# EasyEDA Pro project ProPrj_四串锂电池电源_2025-05-16.epro, schematic SW7203

## Sheets
1 电池保护: Board Name: Board1; Create Date: 2025-04-14; Page Name: 电池保护; Project Name: 四串锂电池电源; Schematic Name: SW7203; Update Date: 2025-04-15; Company: 嘉立创EDA; Page Size: A4; Version: V1.0
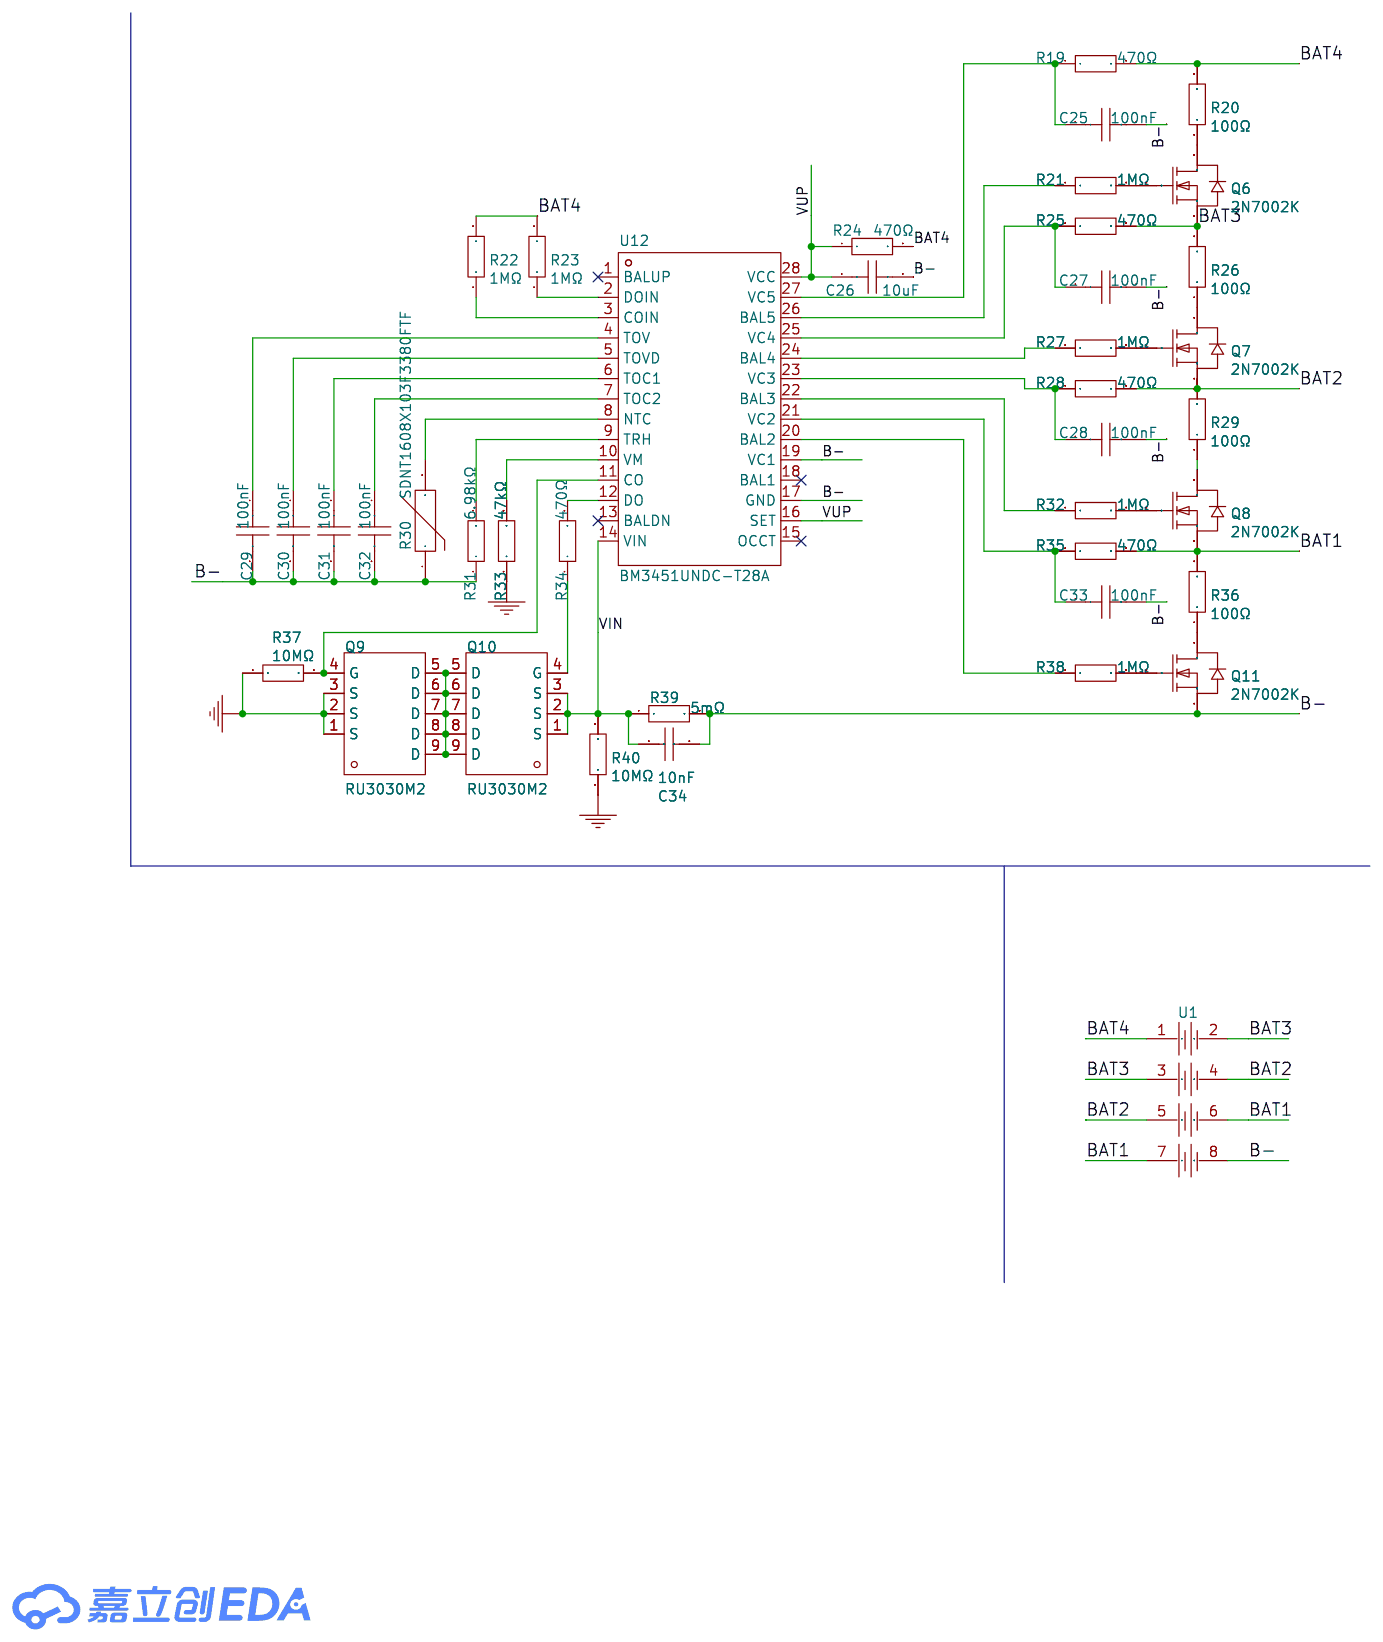
[diagram p0: 电池保护]
2 电源管理: Page Name: 电源管理; Schematic Name: Schematic1; Update Date: 2025-04-14
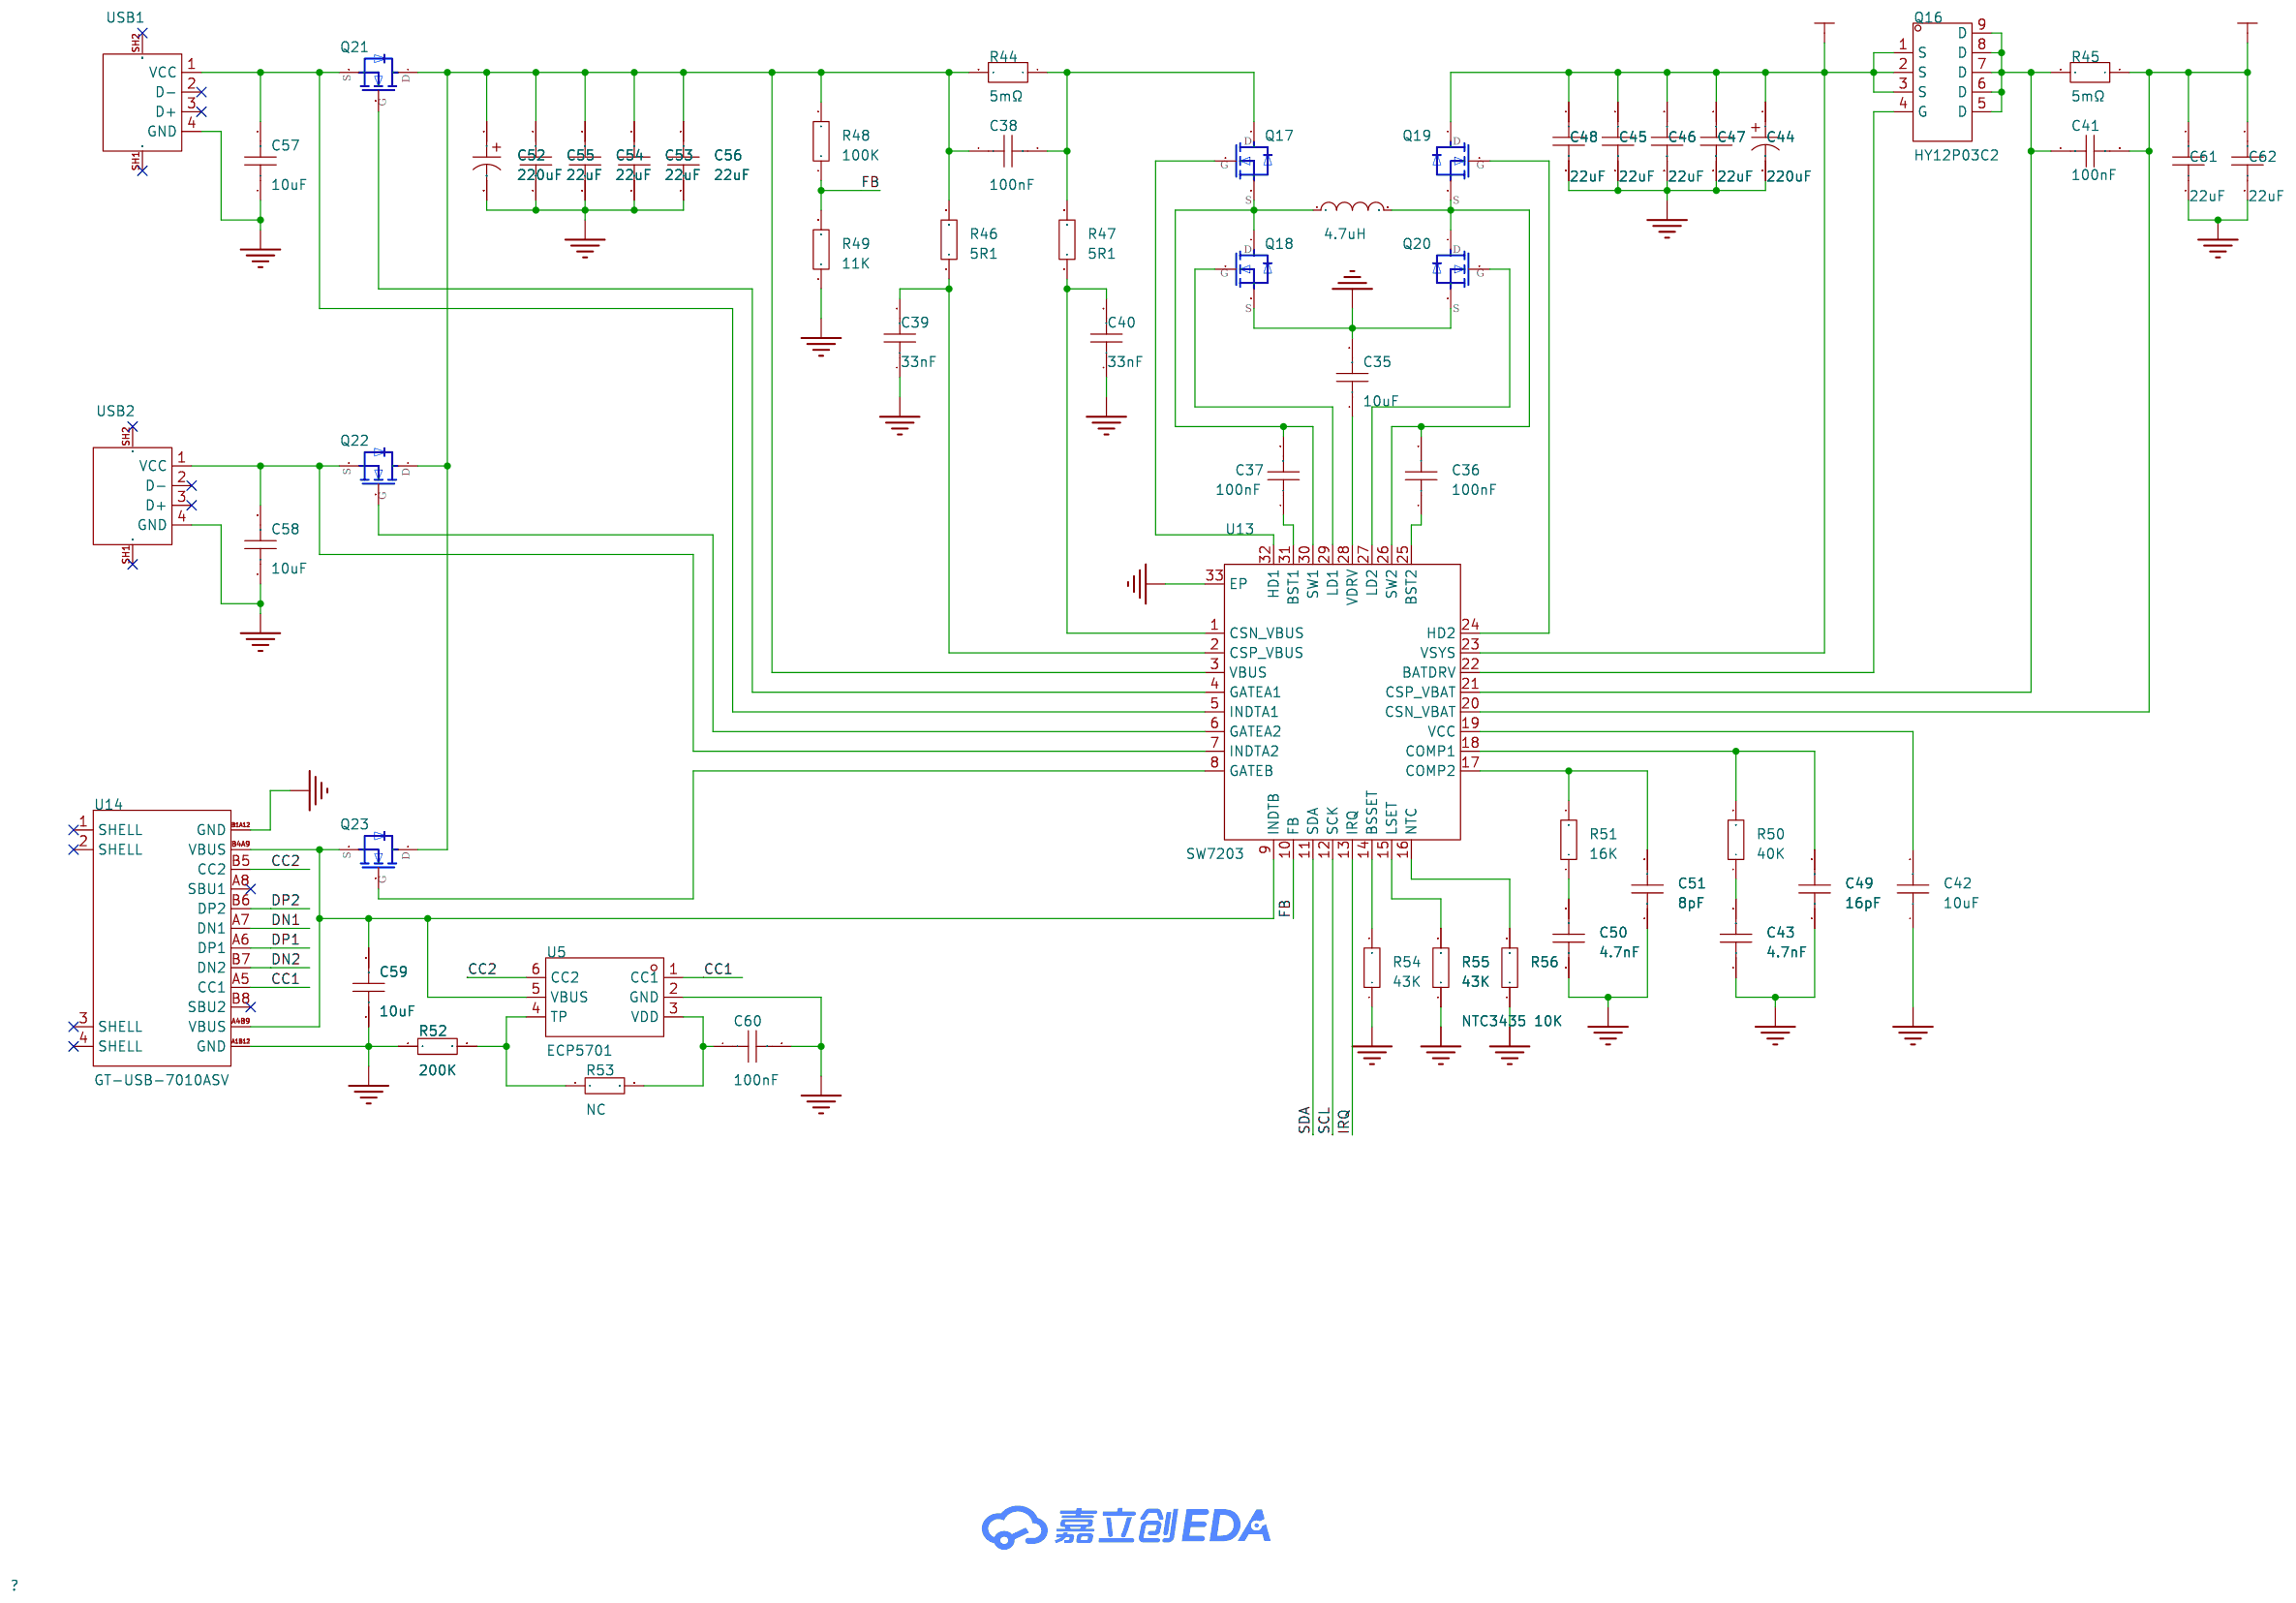
[diagram p1: 电源管理]

## Parts
sheet 电池保护
C25  100nF  [C0603]
C26  10uF  [C0603]
C27  100nF  [C0603]
C28  100nF  [C0603]
C29  100nF  [C0603]
C30  100nF  [C0603]
C31  100nF  [C0603]
C32  100nF  [C0603]
C33  100nF  [C0603]
C34  10nF  [C0603]
Q6  2N7002K  [SOT-23-3_L2.9-W1.3-P1.90-LS2.4-BL-1]
Q7  2N7002K  [SOT-23-3_L2.9-W1.3-P1.90-LS2.4-BL-1]
Q8  2N7002K  [SOT-23-3_L2.9-W1.3-P1.90-LS2.4-BL-1]
Q9  RU3030M2  [PDFN3333-8_L3.1-W3.2-P0.65-LS3.4-BL]
Q10  RU3030M2  [PDFN3333-8_L3.1-W3.2-P0.65-LS3.4-BL]
Q11  2N7002K  [SOT-23-3_L2.9-W1.3-P1.90-LS2.4-BL-1]
R19  470Ω  [R0603]
R20  100Ω  [R0603]
R21  1MΩ  [R0603]
R22  1MΩ  [R0603]
R23  1MΩ  [R0603]
R24  470Ω  [R0603]
R25  470Ω  [R0603]
R26  100Ω  [R0603]
R27  1MΩ  [R0603]
R28  470Ω  [R0603]
R29  100Ω  [R0603]
R30  SDNT1608X103F3380FTF  [R0603]
R31  6.98kΩ  [R0603]
R32  1MΩ  [R0603]
R33  47kΩ  [R0603]
R34  470Ω  [R0603]
R35  470Ω  [R0603]
R36  100Ω  [R0603]
R37  10MΩ  [R0603]
R38  1MΩ  [R0603]
R39  5mΩ  [R1206]
R40  10MΩ  [R0603]
U1  -  [21700四节电池仓]
U12  BM3451UNDC-T28A  [TSSOP-28_L9.7-W4.4-P0.65-LS6.4-BL]
sheet 电源管理
C35  10uF  [C0603]
C36  100nF  [C0603]
C37  100nF  [C0603]
C38  100nF  [C0603]
C39  33nF  [C0603]
C40  33nF  [C0603]
C41  100nF  [C0603]
C42  10uF  [C0805]
C43  4.7nF  [C0805]
C44  220uF  [CAP-SMD_BD8.0-L8.3-W8.3-LS9.0-FD]
C45  22uF  [C0805]
C46  22uF  [C0805]
C47  22uF  [C0805]
C48  22uF  [C0805]
C49  16pF  [C0805]
C50  4.7nF  [C0805]
C51  8pF  [C0805]
C52  220uF  [CAP-SMD_BD8.0-L8.3-W8.3-LS9.0-FD]
C53  22uF  [C0805]
C54  22uF  [C0805]
C55  22uF  [C0805]
C56  22uF  [C0805]
C57  10uF  [C0805]
C58  10uF  [C0805]
C59  10uF  [C0805]
C60  100nF  [C0603]
C61  22uF  [C0805]
C62  22uF  [C0805]
Q16  HY12P03C2  [DFN-8_L5.9-W5.2-P1.27-LS6.2-BL]
Q17  TPN2R703NL  [TSON3x3]
Q18  TPN2R703NL  [TSON3x3]
Q19  TPN2R703NL  [TSON3x3]
Q20  TPN2R703NL  [TSON3x3]
Q21  TPN2R703NL  [TSON3x3]
Q22  TPN2R703NL  [TSON3x3]
Q23  TPN2R703NL  [TSON3x3]
R44  5mΩ  [RES-SMD_L6.4-W3.2-1]
R45  5mΩ  [RES-SMD_L6.4-W3.2-1]
R46  5R1  [R0603]
R47  5R1  [R0603]
R48  100K  [R0603]
R49  11K  [R0603]
R50  40K  [R0603]
R51  16K  [R0603]
R52  200K  [R0603]
R53  NC  [R0603]
R54  43K  [R0603]
R55  43K  [R0603]
R56  NTC3435 10K  [R0603]
U5  ECP5701  [SOT-23-6_L2.9-W1.6-P0.95-LS2.8-BR]
U6  4.7uH  [IND-SMD_L11.0-W10.0]
U13  SW7203  [QFN-32_L4.0-W4.0-P0.40-TL-EP2.7]
U14  GT-USB-7010ASV  [USB-C-SMD_G-SWITCH_GT-USB-7010ASV]
USB1  -  [USB_ Type-A]
USB2  -  [USB_ Type-A]

## Library data of the parts
C25 C27-C33 = CGA0603X7R104K500JT: 容值:100nF;精度:±10%;额定电压:50V;材质(温度系数):X7R;; LCSC Part Name: 100nF ±10% 50V; Supplier Part: C6119867; Manufacturer: HRE(芯声); Supplier Footprint: 0603; JLCPCB Part Class: Extended Part; Supplier: LCSC; Tolerance: ±10%; Voltage Rated: 50V; Temperature Coefficient: X7R
C26 = CL10A106MA8NRNC: 容值:10uF;精度:±20%;额定电压:25V;材质(温度系数):X5R;; LCSC Part Name: 10uF ±20% 25V; Supplier Part: C96446; Manufacturer: SAMSUNG(三星); Supplier Footprint: 0603; JLCPCB Part Class: Basic Part; Datasheet: https://atta.szlcsc.com/upload/public/pdf/source/20160218/1457707763339.pdf; Supplier: LCSC; Tolerance: ±20%; Voltage Rated: 25V; Temperature Coefficient: X5R
C34 = CC0603KRX7R9BB103: 容值:10nF;精度:±10%;额定电压:50V;材质(温度系数):X7R;; LCSC Part Name: 10nF ±10% 50V; Supplier Part: C100042; Manufacturer: YAGEO(国巨); Supplier Footprint: 0603; JLCPCB Part Class: Extended Part; Datasheet: https://atta.szlcsc.com/upload/public/pdf/source/20181008/C309510_22F155564471FAF6A489F7D68F34234E.pdf; Supplier: LCSC; Tolerance: ±10%; Voltage Rated: 50V; Temperature Coefficient: X7R
Q6-Q8 Q11 = 2N7002K_C3008053: 类型:1个N沟道;漏源电压(Vdss):60V;连续漏极电流(Id):300mA;功率(Pd):350mW;导通电阻(RDS(on)@Vgs,Id):2.2Ω@10V,300mA;阈值电压(Vgs(th)@Id):1.6V@250uA;; LCSC Part Name: 1个N沟道 耐压:60V 电流:300mA; Supplier Part: C3008053; Manufacturer: MSKSEMI(美森科); Supplier Footprint: SOT-23; JLCPCB Part Class: Extended Part; Datasheet: https://atta.szlcsc.com/upload/public/pdf/source/20231010/5AB8D059FA255FE9F5E2F13E941A7E6F.pdf; Supplier: LCSC; Type: 1个N沟道; Drain Source Voltage (Vdss): 60V; Continuous Drain Current (Id): 300mA; Power Dissipation (Pd): 350mW; Drain Source On Resistance (RDS(on)@Vgs,Id): 2.2Ω@10V,300mA; Gate Threshold Voltage (Vgs(th)@Id): 1.6V@250uA; Total Gate Charge (Qg@Vgs): 3.7nC@10V; Input Capacitance (Ciss@Vds): 25.5pF@30V; Reverse Transfer Capacitance (Crss@Vds): 7.8pF@30V; Operating Temperature: -50℃~+150℃@(Tj)
Q9 Q10 = RU3030M2: 类型:1个N沟道;漏源电压(Vdss):30V;连续漏极电流(Id):30A;功率(Pd):29W;导通电阻(RDS(on)@Vgs,Id):15mΩ@10V,20A;阈值电压(Vgs(th)@Id):2.5V@250uA;; LCSC Part Name: 1个N沟道 耐压:30V 电流:30A; Supplier Part: C180957; Manufacturer: Ruichips(锐骏半导体); Supplier Footprint: PDFN3333-8; JLCPCB Part Class: 扩展库; Datasheet: https://atta.szlcsc.com/upload/public/pdf/source/20180301/C180957_15198944352791383984.pdf; Supplier: LCSC; Type: 1个N沟道; Drain Source Voltage (Vdss): 30V; Continuous Drain Current (Id): 30A; Power Dissipation (Pd): 29W; Drain Source On Resistance (RDS(on)@Vgs,Id): 15mΩ@10V,20A; Gate Threshold Voltage (Vgs(th)@Id): 2.5V@250uA
R19 R24 R25 R28 R34 R35 = 0603WAF4700T5E: 电阻类型:厚膜电阻;阻值:470Ω;精度:±1%;功率:100mW;最大工作电压:75V;温度系数:±100ppm/℃;; LCSC Part Name: 470Ω ±1% 100mW 厚膜电阻; Supplier Part: C23179; Manufacturer: UNI-ROYAL(厚声); Supplier Footprint: 0603; JLCPCB Part Class: Basic Part; Datasheet: https://atta.szlcsc.com/upload/public/pdf/source/20200306/C422600_1E6D84923E4A46A82E41ADD87F860B5C.pdf; Supplier: LCSC; Type: 厚膜电阻; Tolerance: ±1%; Power(Watts): 100mW; Overload Voltage (Max): 75V; Temperature Coefficient: ±100ppm/℃; Operating Temperature Range: -55℃~+155℃
R20 R26 R29 R36 = 0603WAF1000T5E: 电阻类型:厚膜电阻;阻值:100Ω;精度:±1%;功率:100mW;最大工作电压:75V;温度系数:±200ppm/℃;; LCSC Part Name: 100Ω ±1% 100mW 厚膜电阻; Supplier Part: C22775; Manufacturer: UNI-ROYAL(厚声); Supplier Footprint: 0603; JLCPCB Part Class: Basic Part; Datasheet: https://atta.szlcsc.com/upload/public/pdf/source/20200306/C422600_1E6D84923E4A46A82E41ADD87F860B5C.pdf; Supplier: LCSC; Type: 厚膜电阻; Tolerance: ±1%; Power(Watts): 100mW; Overload Voltage (Max): 75V; Temperature Coefficient: ±200ppm/℃; Operating Temperature Range: -55℃~+155℃
R21-R23 R27 R32 R38 = 0603WAF1004T5E: 电阻类型:厚膜电阻;阻值:1MΩ;精度:±1%;功率:100mW;最大工作电压:75V;温度系数:±100ppm/℃;; LCSC Part Name: 1MΩ ±1% 100mW 厚膜电阻; Supplier Part: C22935; Manufacturer: UNI-ROYAL(厚声); Supplier Footprint: 0603; JLCPCB Part Class: Basic Part; Datasheet: https://atta.szlcsc.com/upload/public/pdf/source/20200306/C422600_1E6D84923E4A46A82E41ADD87F860B5C.pdf; Supplier: LCSC; Type: 厚膜电阻; Tolerance: ±1%; Power(Watts): 100mW; Overload Voltage (Max): 75V; Temperature Coefficient: ±100ppm/℃; Operating Temperature Range: -55℃~+155℃
R30 = SDNT1608X103F3380FTF: 阻值(25℃):10kΩ;B值(25℃/50℃):3380K;电阻精度:±1%;功率:100mW;B值精度:±1%;最大稳态电流(25℃):310uA;; LCSC Part Name: 10kΩ 电阻精度:±1% 3380K; Supplier Part: C316397; Manufacturer: Sunlord(顺络); Supplier Footprint: 0603; JLCPCB Part Class: Extended Part; Datasheet: https://atta.szlcsc.com/upload/public/pdf/source/20210916/BF106A3565EDFEB141CB3E0EA3A661F8.pdf; Supplier: LCSC; Resistance @ 25℃: 10kΩ; B Constant (25℃/50℃): 3380K; Resistance Tolerance: ±1%; Power: 100mW; B Constant Tolerance: ±1%; Steady State Current (Max): 310uA; Operating Temperature: -55℃~+125℃
R31 = FRC0603F6981TS: 电阻类型:厚膜电阻;阻值:6.98kΩ;精度:±1%;功率:100mW;最大工作电压:75V;温度系数:±100ppm/℃;; LCSC Part Name: 6.98kΩ ±1% 100mW 厚膜电阻; Supplier Part: C2930122; Manufacturer: FOJAN(富捷); Supplier Footprint: 0603; JLCPCB Part Class: Extended Part; Datasheet: https://atta.szlcsc.com/upload/public/pdf/source/20211221/925EC7D7225764EE0046F22065062C87.pdf; Supplier: LCSC; Type: 厚膜电阻; Tolerance: ±1%; Power(Watts): 100mW; Overload Voltage (Max): 75V; Temperature Coefficient: ±100ppm/℃; Operating Temperature Range: -55℃~+155℃
R33 = 0603WAF4702T5E: 电阻类型:厚膜电阻;阻值:47kΩ;精度:±1%;功率:100mW;最大工作电压:75V;温度系数:±100ppm/℃;; LCSC Part Name: 47kΩ ±1% 100mW 厚膜电阻; Supplier Part: C25819; Manufacturer: UNI-ROYAL(厚声); Supplier Footprint: 0603; JLCPCB Part Class: Basic Part; Datasheet: https://atta.szlcsc.com/upload/public/pdf/source/20200306/C422600_1E6D84923E4A46A82E41ADD87F860B5C.pdf; Supplier: LCSC; Type: 厚膜电阻; Tolerance: ±1%; Power(Watts): 100mW; Overload Voltage (Max): 75V; Temperature Coefficient: ±100ppm/℃; Operating Temperature Range: -55℃~+155℃
R37 R40 = 0603WAJ0106T5E: 电阻类型:厚膜电阻;阻值:10MΩ;精度:±5%;功率:100mW;最大工作电压:75V;温度系数:±100ppm/℃;; LCSC Part Name: 10MΩ ±5% 100mW 厚膜电阻; Supplier Part: C26097; Manufacturer: UNI-ROYAL(厚声); Supplier Footprint: 0603; JLCPCB Part Class: Extended Part; Datasheet: https://atta.szlcsc.com/upload/public/pdf/source/20200306/C422600_1E6D84923E4A46A82E41ADD87F860B5C.pdf; Supplier: LCSC; Type: 厚膜电阻; Tolerance: ±5%; Power(Watts): 100mW; Overload Voltage (Max): 75V; Temperature Coefficient: ±100ppm/℃; Operating Temperature Range: -55℃~+155℃
R39 = HoLLR1206-1W-5mR-1%: 电阻类型:采样电阻;阻值:5mΩ;精度:±1%;额定压降:-;功率:1W;温度系数:±50ppm/℃;安装方式:贴片;; LCSC Part Name: 5mΩ ±1% 1W; Supplier Part: C2988648; Manufacturer: Milliohm(毫欧); Supplier Footprint: 1206; JLCPCB Part Class: Extended Part; Datasheet: https://atta.szlcsc.com/upload/public/pdf/source/20220407/F189C92CC2C10DCB4BF36375122B9E11.pdf; Supplier: LCSC; Type: 采样电阻; Tolerance: ±1%; Power(Watts): 1W; Rated Current: 31.6A; Temperature Coefficient: ±50ppm/℃; Mounting Sytle: 贴片
U1 = 四节21700电池仓
U12 = BM3451UNDC-T28A: Supplier Part: C94597; Supplier Footprint: TSSOP-28; JLCPCB Part Class: 扩展库; Datasheet: https://atta.szlcsc.com/upload/public/pdf/source/20170417/1492393727246.pdf; Supplier: LCSC
C35-C41 C60 = CAP_0603: Supplier Footprint: 0603
C42 C43 C45-C51 C53-C59 C61 C62 = CAP_0805: Supplier Footprint: 0805
C44 C52 = MA35V220M8x8: 容值:220uF;精度:±20%;额定电压:35V;纹波电流:2.9A@100Hz;等效串联电阻(ESR):28mΩ@100kHz;类型:-;; LCSC Part Name: 220uF ±20% 35V; Supplier Part: C46550469; Manufacturer: 捷而瑞; Supplier Footprint: SMD,D8xL8mm; Datasheet: https://atta.szlcsc.com/upload/public/pdf/source/20250307/6235B7AE82D76EEDCDF841C3AB84160F.pdf; Supplier: LCSC; Tolerance: ±20%; Voltage Rating: 35V; Ripple Current: 2.9A@100Hz; Equivalent Series Resistance(ESR): 28mΩ@100kHz; Diameter: 8mm; Height - Seated (Max): 9mm; Lifetime: 2000hrs@105℃; Operating Temperature: -55℃~+105℃
Q16 = HY12P03C2: 类型:1个P沟道;漏源电压(Vdss):30V;连续漏极电流(Id):50A;导通电阻(RDS(on)@Vgs,Id):14.2mΩ@4.5V,9A;功率(Pd):42W;阈值电压(Vgs(th)@Id):1V@250uA;; LCSC Part Name: 1个P沟道 耐压:30V 电流:50A; Supplier Part: C358006; Manufacturer: HUAYI(华羿微); Supplier Footprint: DFN-8(5.2x5.9); JLCPCB Part Class: 扩展库; Datasheet: https://atta.szlcsc.com/upload/public/pdf/source/20190107/C358006_05F26F72BBBFE8057F7BDEBDD3102847.pdf; Supplier: LCSC; Type: 1个P沟道; Drain Source Voltage (Vdss): 30V; Continuous Drain Current (Id): 50A; Drain Source On Resistance (RDS(on)@Vgs,Id): 14.2mΩ@4.5V,9A; Power Dissipation (Pd): 42W; Gate Threshold Voltage (Vgs(th)@Id): 1V@250uA; Total Gate Charge (Qg@Vgs): 34nC; Input Capacitance (Ciss@Vds): 2.814nF; Reverse Transfer Capacitance (Crss@Vds): 399pF; Operating Temperature: -55℃~+150℃
Q17-Q23 = TPN2R703NL
R44 R45 = HoJLR2512-3W-5mR-1%: 电阻类型:采样电阻;阻值:5mΩ;精度:±1%;功率:3W;安装方式:贴片;; LCSC Part Name: 5mΩ ±1% 3W; Supplier Part: C2903482; Manufacturer: Milliohm(毫欧); Supplier Footprint: 2512; JLCPCB Part Class: 扩展库; Datasheet: https://atta.szlcsc.com/upload/public/pdf/source/20211009/7525CABAB363C979E942C1DD41F1FEF0.pdf; Supplier: LCSC; Type: 采样电阻; Tolerance: ±1%; Power(Watts): 3W; Mounting Sytle: 贴片
R46-R56 = Res_0603: Supplier Footprint: 0603
U5 = ECP5701: Supplier Part: C9900059046; JLCPCB Part Class: 扩展库; Supplier: LCSC
U6 = MPL-AY1050-4R7: 电感值:4.7uH;精度:-;额定电流:11.5A;饱和电流(Isat):15A;类型:-;; LCSC Part Name: 4.7uH 15A; Supplier Part: C3224636; Manufacturer: MPS(芯源); Supplier Footprint: SMD,11x10mm; JLCPCB Part Class: 扩展库; Datasheet: https://atta.szlcsc.com/upload/public/pdf/source/20240315/DD7BB26E83C39D990AA769715C67161A.pdf; Supplier: LCSC; Rated Current: 11.5A; Saturation Current (Isat): 15A; DC Resistance (DCR): 9.5mΩ
U13 = SW7203: Supplier Part: C9900014330; Supplier Footprint: QFN-32-EP(4x4); JLCPCB Part Class: 扩展库; Supplier: LCSC
U14 = GT-USB-7010ASV: 连接器类型:Type-C;标准:USB 2.0;公母:母;安装方式:卧贴;触点数量:16P;端口数量:1;额定电流 - 电源:3A;工作温度范围:-40℃~+85℃;; LCSC Part Name: Type-C 母 卧贴; Supplier Part: C2988369; Manufacturer: G-Switch(品赞); Supplier Footprint: SMD; Datasheet: https://atta.szlcsc.com/upload/public/pdf/source/20230327/DF227B64686AC8FA0AD1775797F2C3F1.pdf; Supplier: LCSC; Connector Type: Type-C; Standard: USB 2.0; Gender: 母; Mounting Style: 卧贴; Number of Contacts: 16P; Number of Ports: 1; Current Rating - Power (Max): 3A; Rated Voltage (Max): 24V; Connect-Disconnect Life: 1万次; Center Height: 1.68mm; Length: 7.35mm; Core Colour: 黑色; Operating Temperature Range: -40℃~+85℃
USB1 USB2 = USB_ Type-A: Supplier Footprint: 插件

## Nets
GND: C35.2 C39.1 C40.1 C42.1 C43.1 C44.2 C45.2 C46.2 C47.2 C48.2 C49.1 C50.1 C51.1 C52.2 C53.2 C54.2 C55.2 C56.2 C57.1 C58.1 C59.1 C60.2 C61.2 C62.2 Q9.1(S) Q9.2(S) Q9.3(S) Q18.3(S) Q20.3(S) R33.1 R37.1 R40.1 R49.1 R52.1 R54.1 R55.1 R56.1 U5.2(GND) U13.33(EP) U14.A1B12(GND) U14.B1A12(GND) USB1.4(GND) USB2.4(GND)
VIN: C34.1 Q10.1(S) Q10.2(S) Q10.3(S) R39.1 R40.2 U12.14(VIN)
B-: C25.2 C26.2 C27.2 C28.2 C29.2 C30.2 C31.2 C32.2 C33.2 C34.2 Q11.2(S) R30.1 R31.1 R39.2 U1.8(2) U12.17(GND) U12.19(VC1)
BAT1: Q8.2(S) R35.2 R36.2 U1.6(2) U1.7(1)
BAT2: Q7.2(S) R28.2 R29.2 U1.4(2) U1.5(1)
BAT3: Q6.2(S) R25.2 R26.2 U1.2 U1.3(1)
BAT4: R19.2 R20.2 R22.2 R23.2 R24.2 U1.1
CC1: U5.1(CC1) U14.A5(CC1)
CC2: U5.6(CC2) U14.B5(CC2)
DN1: U14.A7(DN1)
DN2: U14.B7(DN2)
DP1: U14.A6(DP1)
DP2: U14.B6(DP2)
FB: R48.1 R49.2 U13.10(FB)
IRQ: U13.13(IRQ)
SCL: U13.12(SCK)
SDA: U13.11(SDA)
VAT4: C41.2 C61.1 C62.1 R45.1 U13.20(CSN_VBAT)
VSYS: C44.1 C45.1 C46.1 C47.1 C48.1 Q16.1(S) Q16.2(S) Q16.3(S) Q19.1(D) U13.23(VSYS)
VUP: C26.1 R24.1 U12.16(SET) U12.28(VCC)
$1N1967: C33.1 R35.1 U12.21(VC2)
$1N1968: C28.1 R28.1 U12.23(VC3)
$1N1969: C27.1 R25.1 U12.25(VC4)
$1N1970: C25.1 R19.1 U12.27(VC5)
$1N1971: R38.1 U12.20(BAL2)
$1N1972: R32.1 U12.22(BAL3)
$1N1973: R27.1 U12.24(BAL4)
$1N1974: R21.1 U12.26(BAL5)
$1N1975: R23.1 U12.2(DOIN)
$1N1976: R22.1 U12.3(COIN)
$1N1979: R34.2 U12.12(DO)
$1N1980: R33.2 U12.10(VM)
$1N1981: R31.2 U12.9(TRH)
$1N1982: R30.2 U12.8(NTC)
$1N1983: C32.1 U12.7(TOC2)
$1N1984: C31.1 U12.6(TOC1)
$1N1985: C30.1 U12.5(TOVD)
$1N1986: C29.1 U12.4(TOV)
$1N1987: Q9.5(D) Q9.6(D) Q9.7(D) Q9.8(D) Q9.9(D) Q10.5(D) Q10.6(D) Q10.7(D) Q10.8(D) Q10.9(D)
$1N1992: Q9.4(G) R37.2 U12.11(CO)
$1N1993: Q10.4(G) R34.1
$1N1994: Q11.3(D) R36.1
$1N1995: Q11.1(G) R38.2
$1N1996: Q8.3(D) R29.1
$1N1997: Q8.1(G) R32.2
$1N1998: Q7.3(D) R26.1
$1N1999: Q7.1(G) R27.2
$1N2000: Q6.3(D) R20.1
$1N2001: Q6.1(G) R21.2
$2N383: C35.1 U13.28(VDRV)
$2N881: Q20.2(G) U13.27(LD2)
$2N888: Q18.2(G) U13.29(LD1)
$2N1071: C37.1 U13.31(BST1)
$2N1078: C36.1 U13.25(BST2)
$2N1129: Q17.2(G) U13.32(HD1)
$2N1139: Q19.2(G) U13.24(HD2)
$2N1219: C38.2 Q17.1(D) R44.1 R47.2
$2N1454: C38.1 C52.1 C53.1 C54.1 C55.1 C56.1 Q21.1(D) Q22.1(D) Q23.1(D) R44.2 R46.2 R48.2 U13.3(VBUS)
$2N1653: C39.2 R46.1 U13.2(CSP_VBUS)
$2N1659: C40.2 R47.1 U13.1(CSN_VBUS)
$2N2807: Q16.4(G) U13.22(BATDRV)
$2N2941: C42.2 U13.19(VCC)
$2N3083: C49.2 R50.2 U13.18(COMP1)
$2N3256: C51.2 R51.2 U13.17(COMP2)
$2N3261: C50.2 R51.1
$2N3338: C43.2 R50.1
$2N3578: C41.1 Q16.5(D) Q16.6(D) Q16.7(D) Q16.8(D) Q16.9(D) R45.2 U13.21(CSP_VBAT)
$2N5006: C37.2 Q17.3(S) Q18.1(D) U6.1 U13.30(SW1)
$2N5040: C36.2 Q19.3(S) Q20.1(D) U6.2 U13.26(SW2)
$2N5089: C57.2 Q21.3(S) U13.5(INDTA1) USB1.1(VCC)
$2N5225: Q21.2(G) U13.4(GATEA1)
$2N5308: Q22.2(G) U13.6(GATEA2)
$2N5319: C58.2 Q22.3(S) U13.7(INDTA2) USB2.1(VCC)
$2N5488: Q23.2(G) U13.8(GATEB)
$2N5495: C59.2 Q23.3(S) U5.5(VBUS) U13.9(INDTB) U14.A4B9(VBUS) U14.B4A9(VBUS)
$2N5869: C60.1 R53.2 U5.3(VDD)
$2N5959: R52.2 R53.1 U5.4(TP)
$2N6191: R54.2 U13.14(BSSET)
$2N6328: R55.2 U13.15(LSET)
$2N6334: R56.2 U13.16(NTC)

Not connected (* = marked no-connect by the designer): U12 1(BALUP)* 13(BALDN)* 15(OCCT)* 18(BAL1)*; U14 1(SHELL)* 2(SHELL)* 3(SHELL)* 4(SHELL)* A8(SBU1)* B8(SBU2)*; USB1 2(D-)* 3(D+)* SH1* SH2*; USB2 2(D-)* 3(D+)* SH1* SH2*
